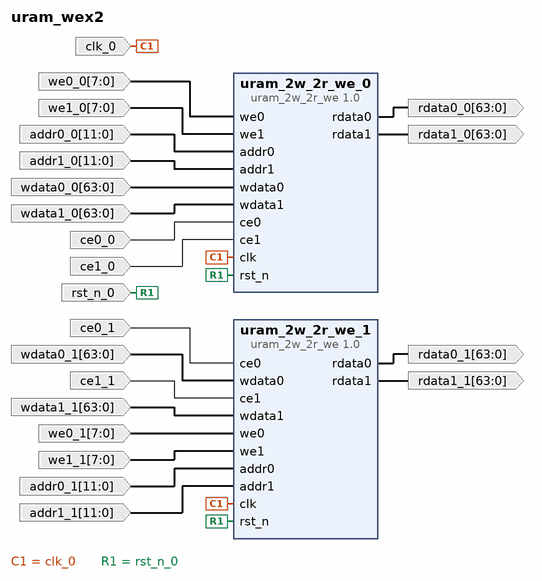
[diagram p0: block diagram of the top level]
# Vivado block design uram_wex2, xcu280-fsvh2892-2L-e, Vivado 2020.2
create_bd_design uram_wex2

create_bd_port -dir I -type clk clk_0
create_bd_port -dir I -type rst rst_n_0
create_bd_port -dir I -from 7 -to 0 we0_0
create_bd_port -dir I -from 7 -to 0 we1_0
create_bd_port -dir I -from 11 -to 0 addr0_0
create_bd_port -dir I -from 11 -to 0 addr1_0
create_bd_port -dir O -from 63 -to 0 rdata0_0
create_bd_port -dir O -from 63 -to 0 rdata1_0
create_bd_port -dir I -from 63 -to 0 wdata0_0
create_bd_port -dir I -from 63 -to 0 wdata1_0
create_bd_port -dir I ce0_0
create_bd_port -dir I ce1_0
create_bd_port -dir O -from 63 -to 0 rdata0_1
create_bd_port -dir O -from 63 -to 0 rdata1_1
create_bd_port -dir I ce0_1
create_bd_port -dir I -from 63 -to 0 wdata0_1
create_bd_port -dir I ce1_1
create_bd_port -dir I -from 63 -to 0 wdata1_1
create_bd_port -dir I -from 7 -to 0 we0_1
create_bd_port -dir I -from 7 -to 0 we1_1
create_bd_port -dir I -from 11 -to 0 addr0_1
create_bd_port -dir I -from 11 -to 0 addr1_1

create_bd_cell -type ip -vlnv user.org:user:uram_2w_2r_we:1.0 uram_2w_2r_we_0
create_bd_cell -type ip -vlnv user.org:user:uram_2w_2r_we:1.0 uram_2w_2r_we_1

# ---- connections ----

connect_bd_net -net clk_0_1 [get_bd_ports clk_0] [get_bd_pins uram_2w_2r_we_0/clk] [get_bd_pins uram_2w_2r_we_1/clk]
connect_bd_net -net rst_n_0_1 [get_bd_ports rst_n_0] [get_bd_pins uram_2w_2r_we_0/rst_n] [get_bd_pins uram_2w_2r_we_1/rst_n]
connect_bd_net -net we0_0_1 [get_bd_ports we0_0] [get_bd_pins uram_2w_2r_we_0/we0]
connect_bd_net -net we1_0_1 [get_bd_ports we1_0] [get_bd_pins uram_2w_2r_we_0/we1]
connect_bd_net -net addr0_0_1 [get_bd_ports addr0_0] [get_bd_pins uram_2w_2r_we_0/addr0]
connect_bd_net -net addr1_0_1 [get_bd_ports addr1_0] [get_bd_pins uram_2w_2r_we_0/addr1]
connect_bd_net [get_bd_pins uram_2w_2r_we_0/rdata0] [get_bd_ports rdata0_0]
connect_bd_net [get_bd_pins uram_2w_2r_we_0/rdata1] [get_bd_ports rdata1_0]
connect_bd_net -net wdata0_0_1 [get_bd_ports wdata0_0] [get_bd_pins uram_2w_2r_we_0/wdata0]
connect_bd_net -net wdata1_0_1 [get_bd_ports wdata1_0] [get_bd_pins uram_2w_2r_we_0/wdata1]
connect_bd_net -net ce0_0_1 [get_bd_ports ce0_0] [get_bd_pins uram_2w_2r_we_0/ce0]
connect_bd_net -net ce1_0_1 [get_bd_ports ce1_0] [get_bd_pins uram_2w_2r_we_0/ce1]
connect_bd_net [get_bd_pins uram_2w_2r_we_1/rdata0] [get_bd_ports rdata0_1]
connect_bd_net [get_bd_pins uram_2w_2r_we_1/rdata1] [get_bd_ports rdata1_1]
connect_bd_net -net ce0_1_1 [get_bd_ports ce0_1] [get_bd_pins uram_2w_2r_we_1/ce0]
connect_bd_net -net wdata0_1_1 [get_bd_ports wdata0_1] [get_bd_pins uram_2w_2r_we_1/wdata0]
connect_bd_net -net ce1_1_1 [get_bd_ports ce1_1] [get_bd_pins uram_2w_2r_we_1/ce1]
connect_bd_net -net wdata1_1_1 [get_bd_ports wdata1_1] [get_bd_pins uram_2w_2r_we_1/wdata1]
connect_bd_net -net we0_1_1 [get_bd_ports we0_1] [get_bd_pins uram_2w_2r_we_1/we0]
connect_bd_net -net we1_1_1 [get_bd_ports we1_1] [get_bd_pins uram_2w_2r_we_1/we1]
connect_bd_net -net addr0_1_1 [get_bd_ports addr0_1] [get_bd_pins uram_2w_2r_we_1/addr0]
connect_bd_net -net addr1_1_1 [get_bd_ports addr1_1] [get_bd_pins uram_2w_2r_we_1/addr1]

validate_bd_design
save_bd_design
